# EAGLE schematic Scintilla-Version 1.0 (EAGLE 9.7.0)
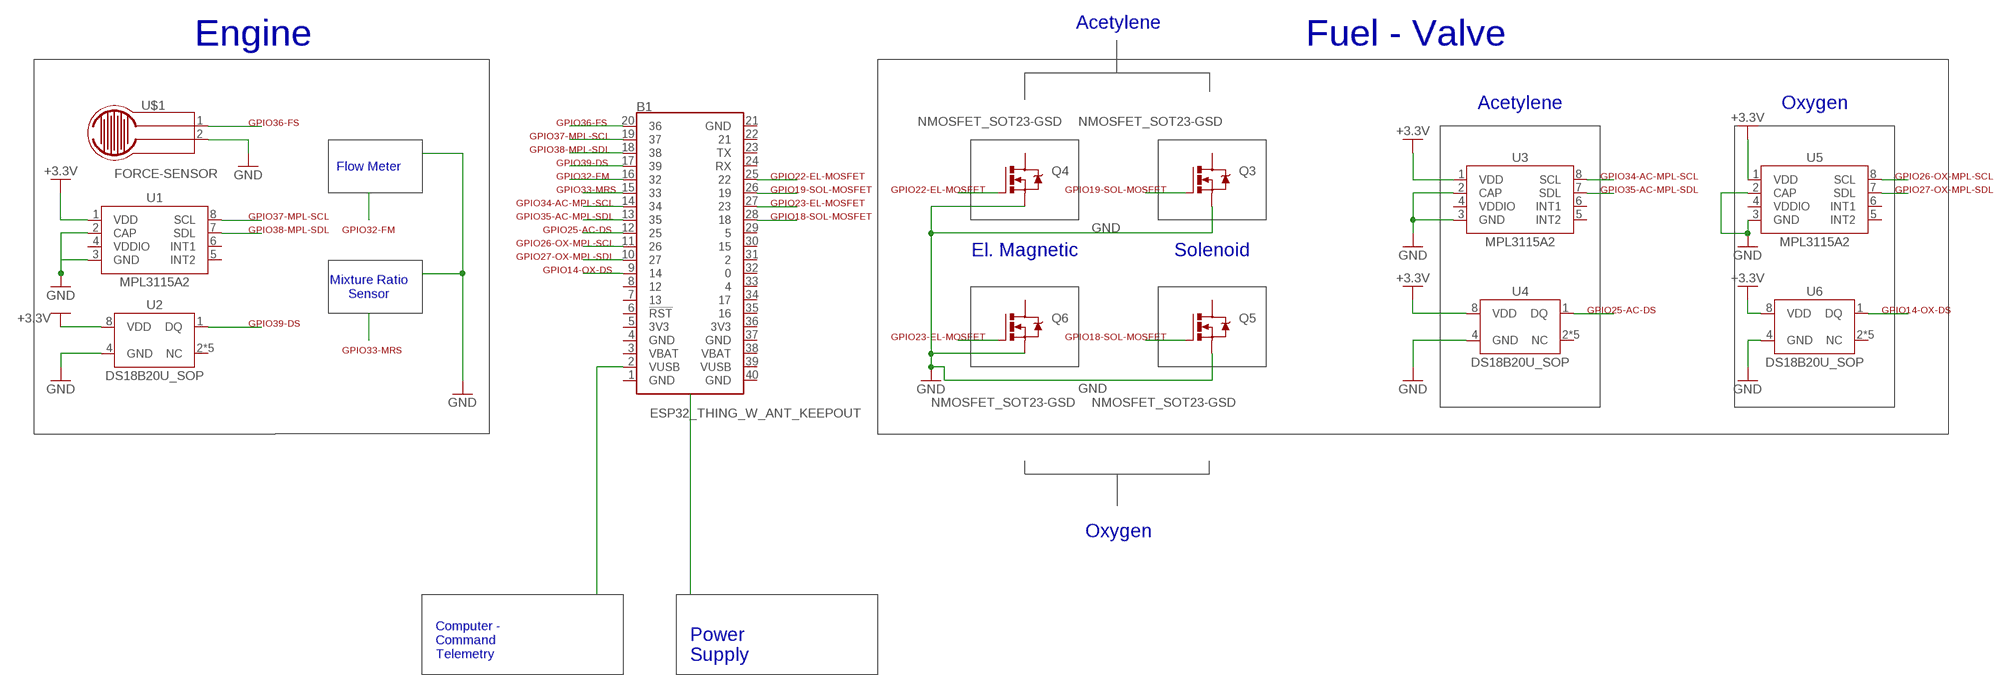
[diagram p0: schematic, sheet 1]

## Parts
B1  ESP32_THING_W_ANT_KEEPOUT  [ESP32_THING]
Q3  NMOSFET_SOT23-GSD  [SOT23]
Q4  NMOSFET_SOT23-GSD  [SOT23]
Q5  NMOSFET_SOT23-GSD  [SOT23]
Q6  NMOSFET_SOT23-GSD  [SOT23]
U1  MPL3115A2  [MPL3115A2_LGA8]
U2  DS18B20U_SOP  [SOP65P491X110-8N]
U3  MPL3115A2  [MPL3115A2_LGA8]
U4  DS18B20U_SOP  [SOP65P491X110-8N]
U5  MPL3115A2  [MPL3115A2_LGA8]
U6  DS18B20U_SOP  [SOP65P491X110-8N]
U$1  FORCE-SENSOR  [1X02]

## Nets
+3.3V: U1.1(VDD) U2.8(VDD) U3.1(VDD) U4.8(VDD) U5.1(VDD) U6.8(VDD)
GND: Q3.2(S) Q4.2(S) Q5.2(S) Q6.2(S) U1.2(CAP) U1.3(GND) U2.4(GND) U3.2(CAP) U3.3(GND) U4.4(GND) U5.2(CAP) U5.3(GND) U6.4(GND) U$1.2
GPIO14-OX-DS: B1.9 U6.1(DQ)
GPIO18-SOL-MOSFET: B1.28 Q5.1(G)
GPIO19-SOL-MOSFET: B1.26 Q3.1(G)
GPIO22-EL-MOSFET: B1.25 Q4.1(G)
GPIO23-EL-MOSFET: B1.27 Q6.1(G)
GPIO25-AC-DS: B1.12 U4.1(DQ)
GPIO26-OX-MPL-SCL: B1.11 U5.8(SCL)
GPIO27-OX-MPL-SDL: B1.10 U5.7(SDL)
GPIO32-FM: B1.16
GPIO33-MRS: B1.15
GPIO34-AC-MPL-SCL: B1.14 U3.8(SCL)
GPIO35-AC-MPL-SDL: B1.13 U3.7(SDL)
GPIO36-FS: B1.20 U$1.1
GPIO37-MPL-SCL: B1.19 U1.8(SCL)
GPIO38-MPL-SDL: B1.18 U1.7(SDL)
GPIO39-DS: B1.17 U2.1(DQ)
N$5: B1.2(VUSB)
Unconnected: B1.1(GND) B1.3(VBAT) B1.4(GND) B1.5(3V3) B1.6(!RST!) B1.7 B1.8 B1.21(GND) B1.22 B1.23(TX) B1.24(RX) B1.29 B1.30 B1.31 B1.32 B1.33 B1.34 B1.35 B1.36(3V3) B1.37(GND) B1.38(VBAT) B1.39(VUSB) B1.40(GND) Q3.3(D) Q4.3(D) Q5.3(D) Q6.3(D) U1.4(VDDIO) U1.5(INT2) U1.6(INT1) U2.2(NC) U2.3(NC) U2.5(NC) U2.6(NC) U2.7(NC) U3.4(VDDIO) U3.5(INT2) U3.6(INT1) U4.2(NC) U4.3(NC) U4.5(NC) U4.6(NC) U4.7(NC) U5.4(VDDIO) U5.5(INT2) U5.6(INT1) U6.2(NC) U6.3(NC) U6.5(NC) U6.6(NC) U6.7(NC)

## Notes on the sheet
- Acetylene
- Engine | Fuel - Valve
- Acetylene | Oxygen
- Flow Meter
- GND
- El. Magnetic | Solenoid
- Mixture Ratio
  Sensor
- GND
- Oxygen
- Computer -
  Command
  Telemetry
- Power
  Supply

## Library data of the parts
B1 = SparkFun-Boards:ESP32_THING: SparkFun ESP32 Thing Board Pins, silkscreen, and logos matching the layout of the SparkFun ESP32 Thing <https://www.sparkfun.com/products/13907> Dimensions: 2.32" x 1.00"
Q3-Q6 = Transistor:NMOSFET: N-Channel MOSFET - Generic
U1 U3 U5 = Sensor:MPL3115A2: I2C precision pressure sensor with altimetry Datasheet <https://www.nxp.com/docs/en/data-sheet/MPL3115A2.pdf>
U2 U4 U6 = Sensor:DS18B20U: Programmable Resolution 1-Wire Digital Thermometer.
U$1 = Tinkercad:FORCE-SENSOR